# Altium schematic sheet 04.SchDoc
size 594 x 420 mm
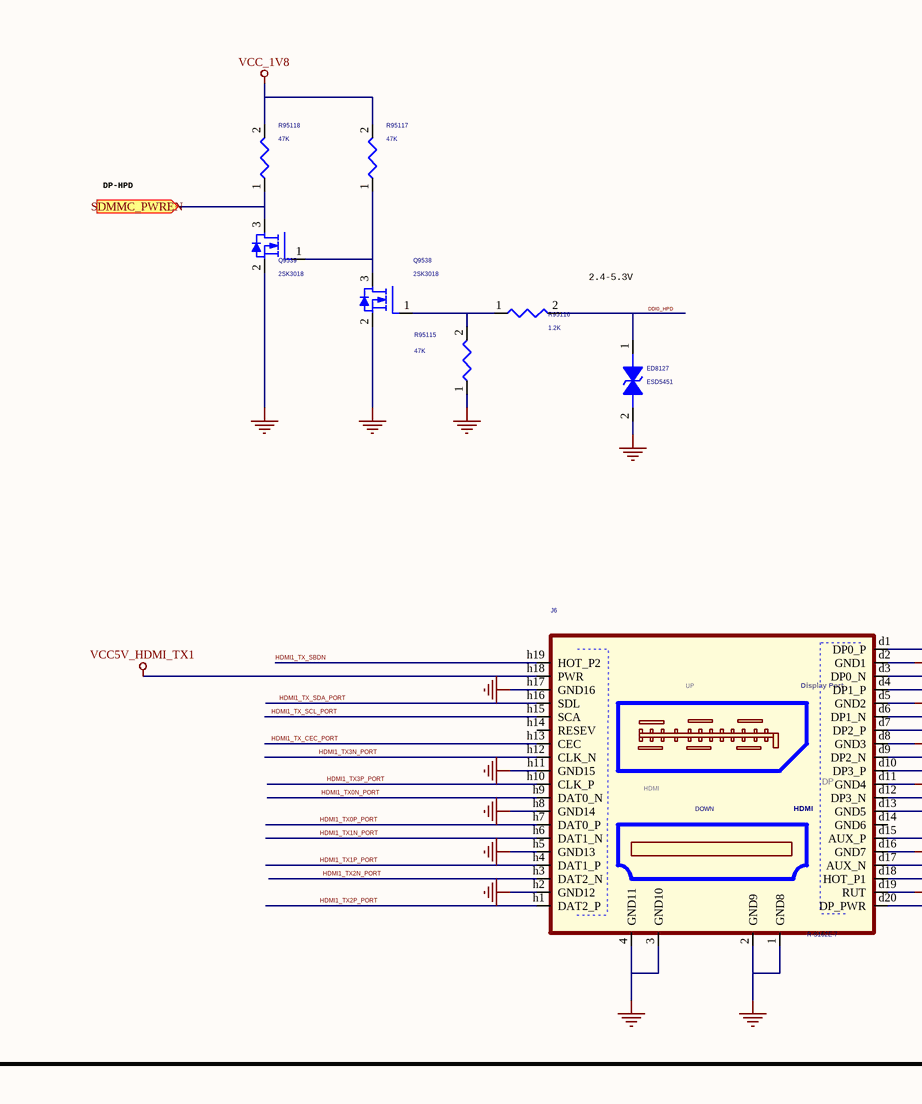
[diagram p0: 04.SchDoc, top left]
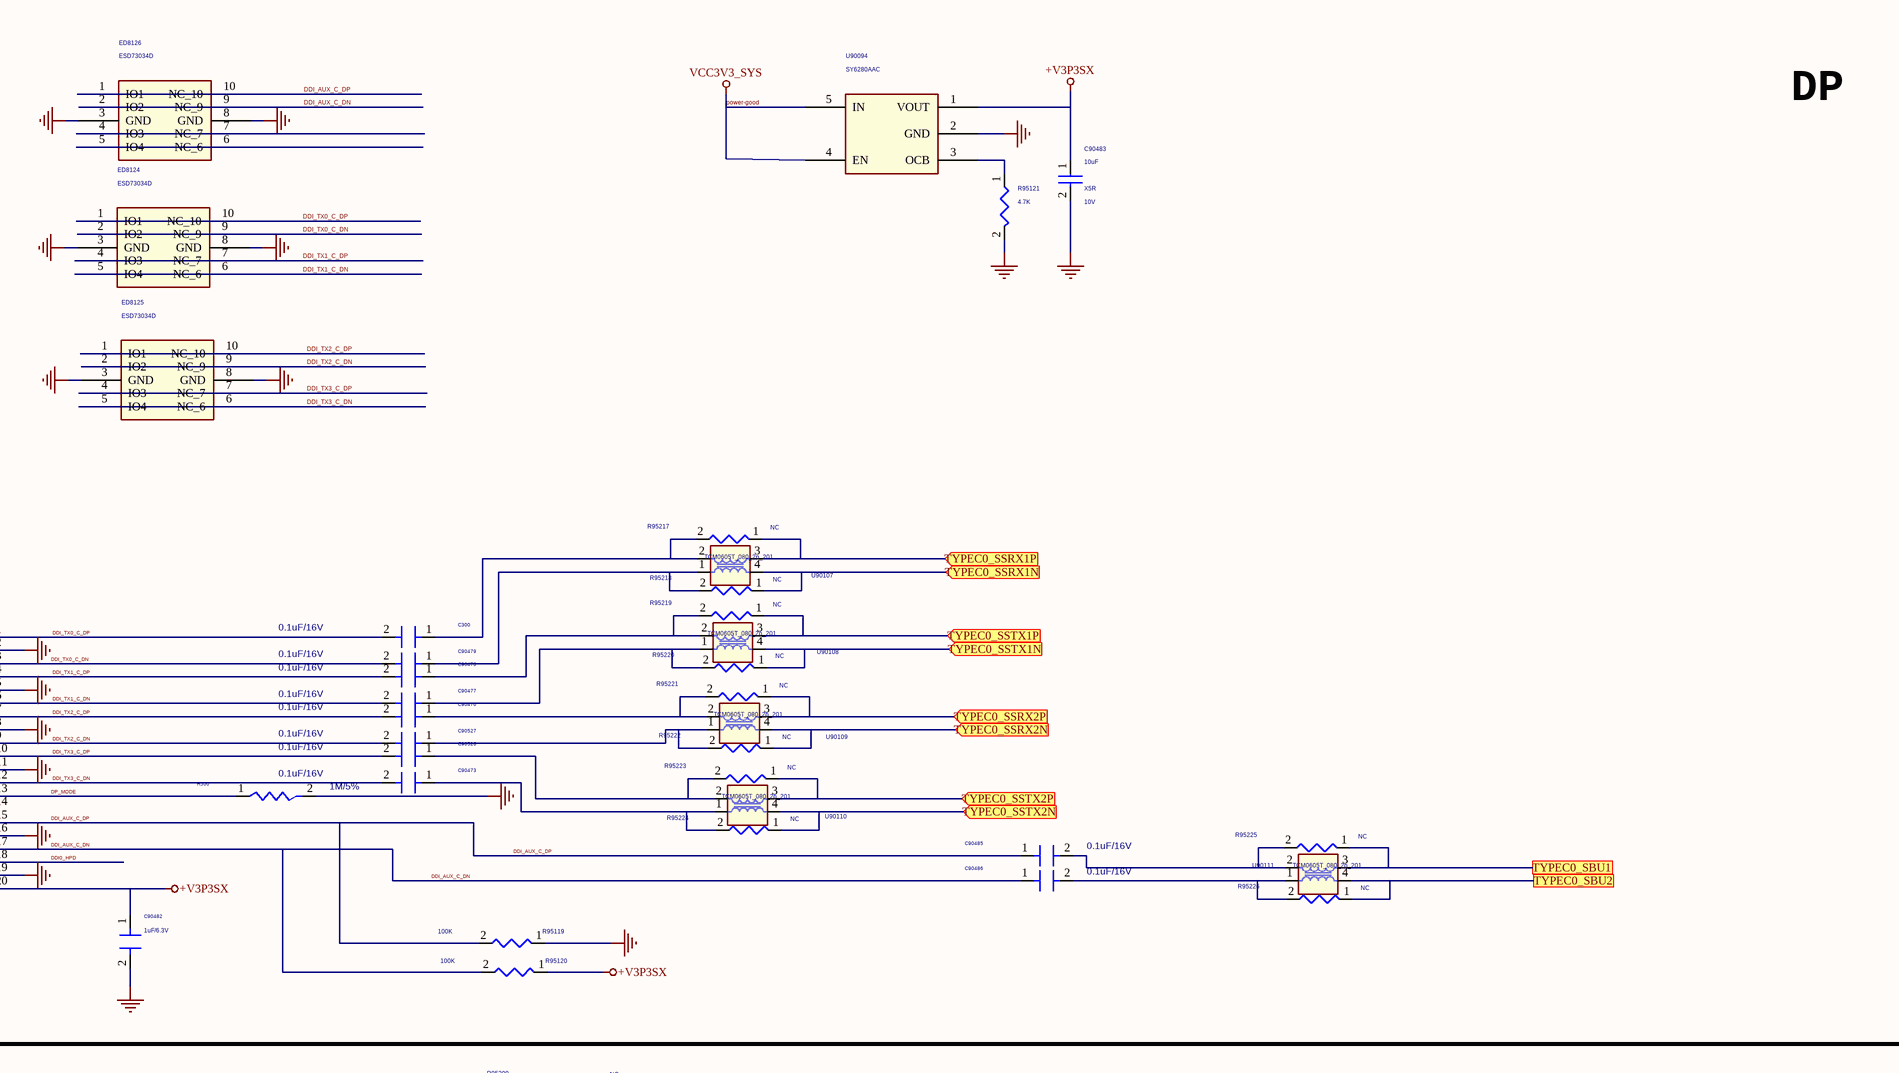
[diagram p1: 04.SchDoc, top right]
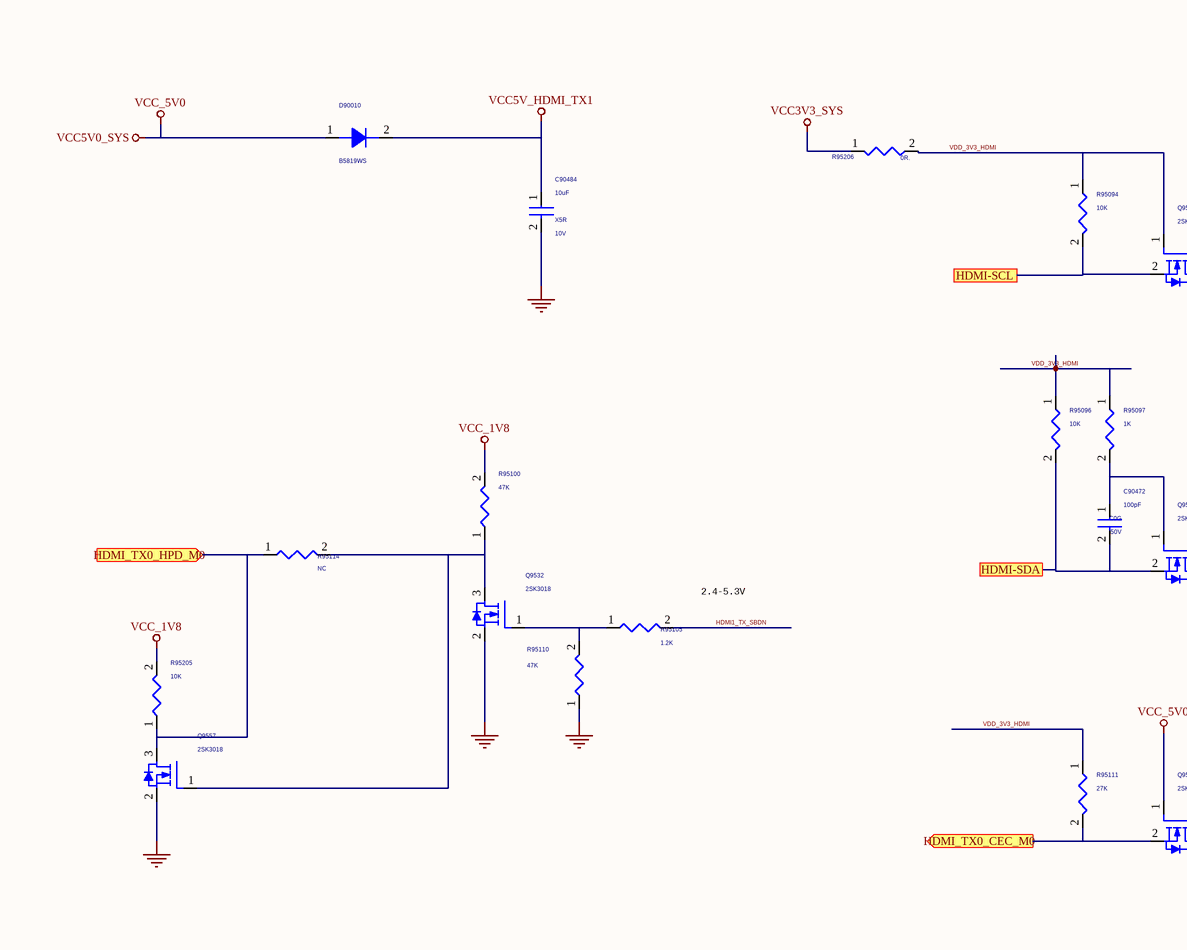
[diagram p2: 04.SchDoc, bottom left]
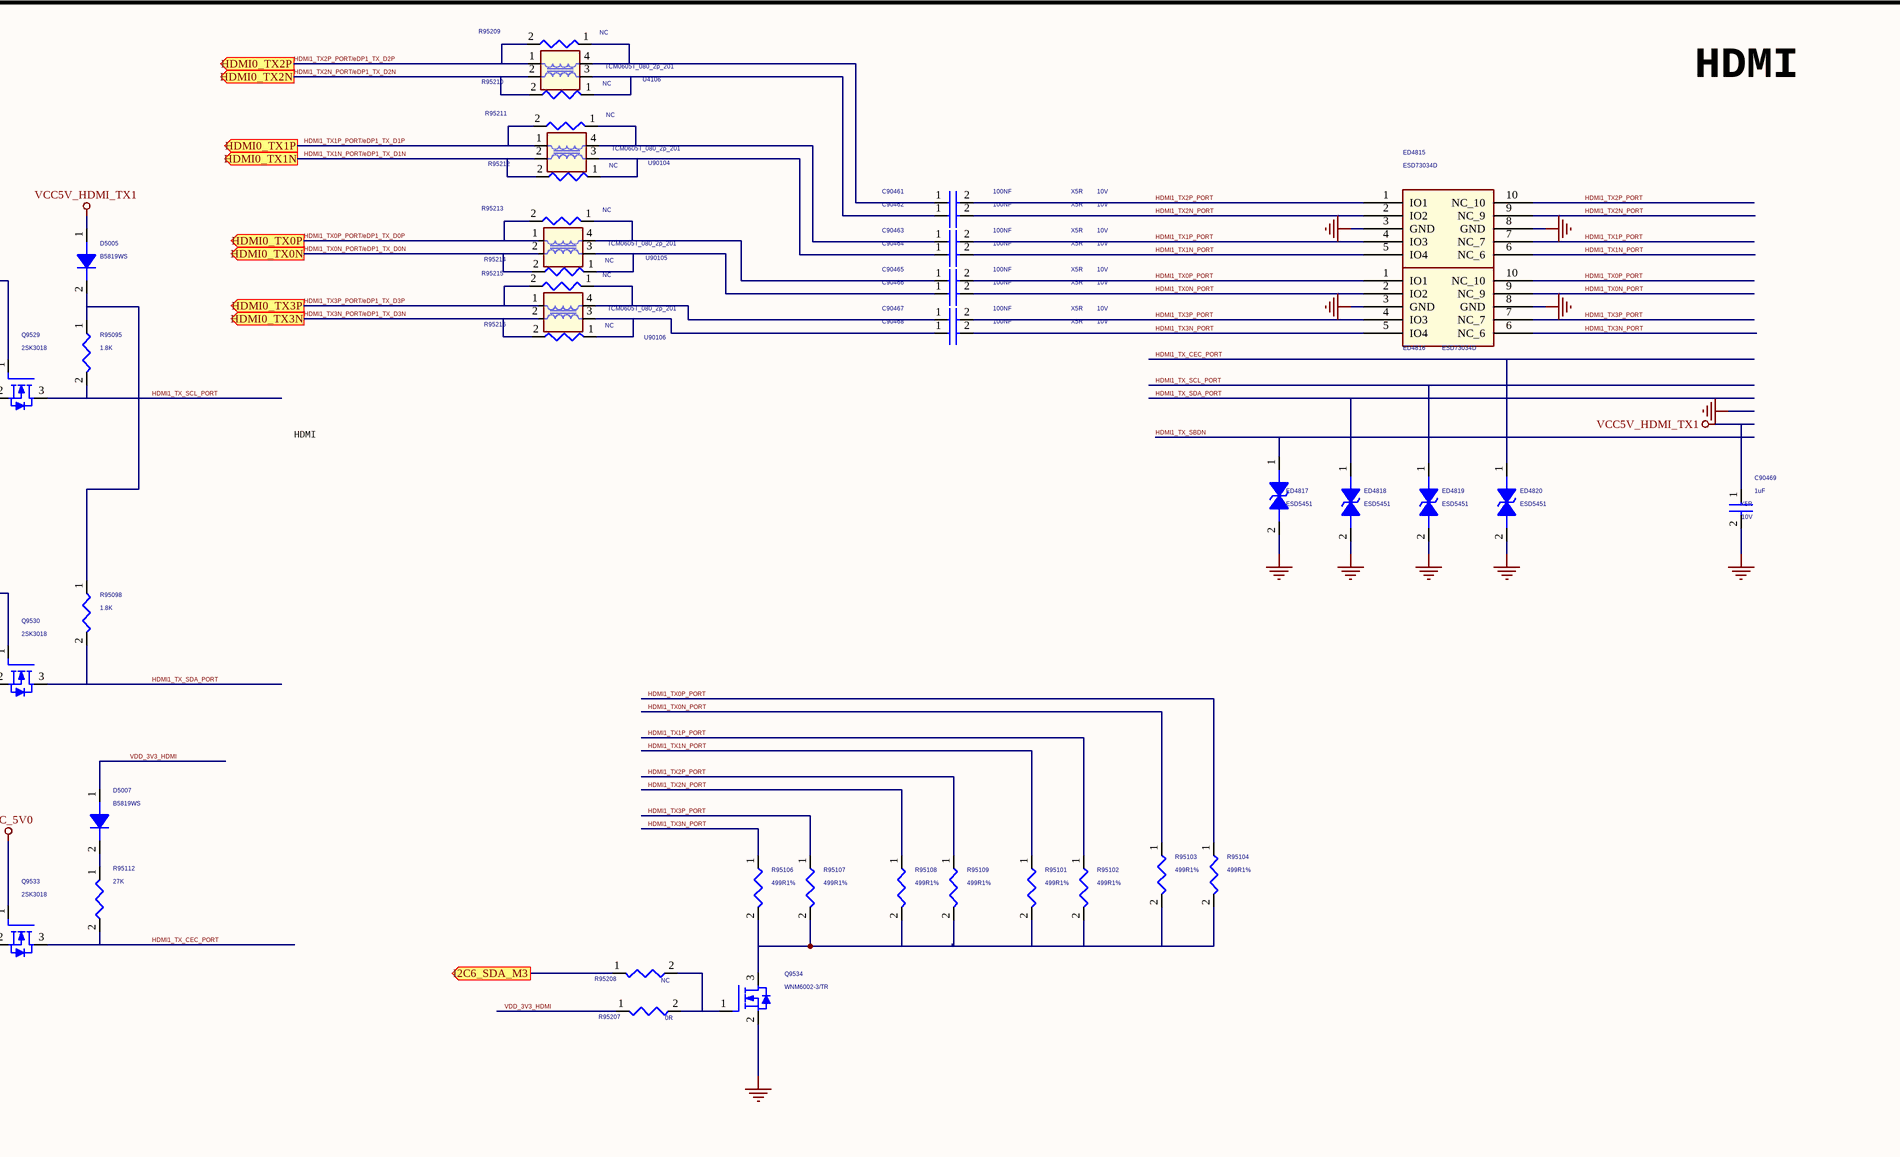
[diagram p3: 04.SchDoc, bottom right]

## Parts
C300  0.1uF/16V  [SMC0201]
C90461  100NF  Voltage: 10V  Dielectric: X5R  [C0201]
C90462  100NF  Voltage: 10V  Dielectric: X5R  [C0201]
C90463  100NF  Voltage: 10V  Dielectric: X5R  [C0201]
C90464  100NF  Voltage: 10V  Dielectric: X5R  [C0201]
C90465  100NF  Voltage: 10V  Dielectric: X5R  [C0201]
C90466  100NF  Voltage: 10V  Dielectric: X5R  [C0201]
C90467  100NF  Voltage: 10V  Dielectric: X5R  [C0201]
C90468  100NF  Voltage: 10V  Dielectric: X5R  [C0201]
C90469  1uF  Voltage: 10V  Dielectric: X5R  [C0402]
C90472  100pF  Voltage: 50V  Dielectric: C0G  [C0402]
C90473  0.1uF/16V  [SMC0201]
C90476  0.1uF/16V  [SMC0201]
C90477  0.1uF/16V  [SMC0201]
C90478  0.1uF/16V  [SMC0201]
C90479  0.1uF/16V  [SMC0201]
C90482  1uF/6.3V  [SMC0402]
C90483  10uF  Voltage: 10V  Dielectric: X5R  [C0603]
C90484  10uF  Voltage: 10V  Dielectric: X5R  [C0603]
C90485  0.1uF/16V  [SMC0201]
C90486  0.1uF/16V  [SMC0201]
C90526  0.1uF/16V  [SMC0201]
C90527  0.1uF/16V  [SMC0201]
D5005  B5819WS  [SOD_323]
D5007  B5819WS  [SOD_323]
D90010  B5819WS  [SOD_323]
ED4815  ESD73034D  [SON10_2R50X1R00X0R50]
ED4816  ESD73034D  [SON10_2R50X1R00X0R50]
ED4817  ESD5451  [ESD0402]
ED4818  ESD5451  [ESD0402]
ED4819  ESD5451  [ESD0402]
ED4820  ESD5451  [ESD0402]
ED8124  ESD73034D  [SON10_2R50X1R00X0R50]
ED8125  ESD73034D  [SON10_2R50X1R00X0R50]
ED8126  ESD73034D  [SON10_2R50X1R00X0R50]
ED8127  ESD5451  [ESD0402]
J6  R-S162E-7  [A]
Q9529  2SK3018  [SOT23]
Q9530  2SK3018  [SOT23]
Q9532  2SK3018  [SOT23]
Q9533  2SK3018  [SOT23]
Q9534  WNM6002-3/TR  [SOT23]
Q9538  2SK3018  [SOT23]
Q9539  2SK3018  [SOT23]
Q9557  2SK3018  [SOT23]
R500  1M/5%  [SMR0402]
R95094  10K  [R0402]
R95095  1.8K  [R0402]
R95096  10K  [R0402]
R95097  1K  [R0402]
R95098  1.8K  [R0402]
R95100  47K  [R0402]
R95101  499R1%  [R0402]
R95102  499R1%  [R0402]
R95103  499R1%  [R0402]
R95104  499R1%  [R0402]
R95105  1.2K  [R0402]
R95106  499R1%  [R0402]
R95107  499R1%  [R0402]
R95108  499R1%  [R0402]
R95109  499R1%  [R0402]
R95110  47K  [R0402]
R95111  27K  [R0402]
R95112  27K  [R0402]
R95114  NC  [R0402]
R95115  47K  [R0402]
R95116  1.2K  [R0402]
R95117  47K  [R0402]
R95118  47K  [R0402]
R95119  100K  [R0402]
R95120  100K  [R0402]
R95121  4.7K  [R0402]
R95205  10K  [R0402]
R95206  0R.  [R0402]
R95207  0R  [R0402]
R95208  NC  [R0402]
R95209  NC  [R0402]
R95210  NC  [R0402]
R95211  NC  [R0402]
R95212  NC  [R0402]
R95213  NC  [R0402]
R95214  NC  [R0402]
R95215  NC  [R0402]
R95216  NC  [R0402]
R95217  NC  [R0402]
R95218  NC  [R0402]
R95219  NC  [R0402]
R95220  NC  [R0402]
R95221  NC  [R0402]
R95222  NC  [R0402]
R95223  NC  [R0402]
R95224  NC  [R0402]
R95225  NC  [R0402]
R95226  NC  [R0402]
U4106  TCM0605T_080_2p_201  [QTCW2012]
U90094  SY6280AAC  [SOT_23_5]
U90104  TCM0605T_080_2p_201  [QTCW2012]
U90105  TCM0605T_080_2p_201  [QTCW2012]
U90106  TCM0605T_080_2p_201  [QTCW2012]
U90107  TCM0605T_080_2p_201  [QTCW2012]
U90108  TCM0605T_080_2p_201  [QTCW2012]
U90109  TCM0605T_080_2p_201  [QTCW2012]
U90110  TCM0605T_080_2p_201  [QTCW2012]
U90111  TCM0605T_080_2p_201  [QTCW2012]

## Ports
HDMI0_TX0N (out), HDMI0_TX0P (out), HDMI0_TX1N (out), HDMI0_TX1P (out), HDMI0_TX2N (out), HDMI0_TX2P (out), HDMI0_TX3N (out), HDMI0_TX3P (out), HDMI-SCL, HDMI-SDA, HDMI_TX0_CEC_M0 (out), HDMI_TX0_HPD_M0 (in), I2C6_SDA_M3 (out), SDMMC_PWREN (in), TYPEC0_SBU1, TYPEC0_SBU2, TYPEC0_SSRX1N (in), TYPEC0_SSRX1P (in), TYPEC0_SSRX2N (in), TYPEC0_SSRX2P (in), TYPEC0_SSTX1N (in), TYPEC0_SSTX1P (in), TYPEC0_SSTX2N (in), TYPEC0_SSTX2P (in)

## Nets
+V3P3SX: C90482.1(A[0]) C90483.1 J6.d20(DP_PWR) R95120.1 U90094.1(VOUT)
GND: C90469.2 C90482.2(B[0]) C90483.2 C90484.2 ED4815.3(GND) ED4815.8(GND) ED4816.3(GND) ED4816.8(GND) ED4817.2 ED4818.2 ED4819.2 ED4820.2 ED8124.3(GND) ED8124.8(GND) ED8125.3(GND) ED8125.8(GND) ED8126.3(GND) ED8126.8(GND) ED8127.2 J6.1(GND8) J6.2(GND9) J6.3(GND10) J6.4(GND11) J6.d2(GND1) J6.d5(GND2) J6.d8(GND3) J6.d11(GND4) J6.d16(GND7) J6.d19(RUT) J6.h2(GND12) J6.h5(GND13) J6.h8(GND14) J6.h11(GND15) J6.h17(GND16) Q9532.2(SOURCE) Q9534.2(SOURCE) Q9538.2(SOURCE) Q9539.2(SOURCE) Q9557.2(SOURCE) R500.2(B[0]) R95110.1 R95115.1 R95119.1 R95121.2 U90094.2(GND)
power-good: R95206.1 U90094.4(EN) U90094.5(IN)  [also labelled VCC3V3_SYS]
VCC5V0_SYS: D90010.1(A) Q9533.1(GATE)  [also labelled VCC_5V0]
VCC5V_HDMI_TX1: C90469.1 C90484.1 D5005.1(A) D90010.2(K) J6.h18(PWR)
VCC_1V8: R95100.2 R95117.2 R95118.2 R95205.2
DDI0_HPD: ED8127.1 J6.d18(HOT_P1) R95116.2
DDI_AUX_C_DN: C90486.1(A[0]) ED8126.2(IO2) ED8126.9(NC_9) J6.d17(AUX_N) R95120.2
DDI_AUX_C_DP: C90485.1(A[0]) ED8126.1(IO1) ED8126.10(NC_10) J6.d15(AUX_P) R95119.2
DDI_TX0_C_DN: C90479.2(B[0]) ED8124.2(IO2) ED8124.9(NC_9) J6.d3(DP0_N)
DDI_TX0_C_DP: C300.2(B[0]) ED8124.1(IO1) ED8124.10(NC_10) J6.d1(DP0_P)
DDI_TX1_C_DN: C90477.2(B[0]) ED8124.5(IO4) ED8124.6(NC_6) J6.d6(DP1_N)
DDI_TX1_C_DP: C90478.2(B[0]) ED8124.4(IO3) ED8124.7(NC_7) J6.d4(DP1_P)
DDI_TX2_C_DN: C90527.2(B[0]) ED8125.2(IO2) ED8125.9(NC_9) J6.d9(DP2_N)
DDI_TX2_C_DP: C90476.2(B[0]) ED8125.1(IO1) ED8125.10(NC_10) J6.d7(DP2_P)
DDI_TX3_C_DN: C90473.2(B[0]) ED8125.5(IO4) ED8125.6(NC_6) J6.d12(DP3_N)
DDI_TX3_C_DP: C90526.2(B[0]) ED8125.4(IO3) ED8125.7(NC_7) J6.d10(DP3_P)
DP_MODE: J6.d13(GND5) R500.1(A[0])
HDMI1_TX0N_PORT: C90466.2 ED4816.2(IO2) ED4816.9(NC_9) J6.h9(DAT0_N) R95103.1
HDMI1_TX0N_PORT/eDP1_TX_D0N: R95214.2 U90105.2 ; port HDMI0_TX0N
HDMI1_TX0P_PORT: C90465.2 ED4816.1(IO1) ED4816.10(NC_10) J6.h7(DAT0_P) R95104.1
HDMI1_TX0P_PORT/eDP1_TX_D0P: R95213.2 U90105.1 ; port HDMI0_TX0P
HDMI1_TX1N_PORT: C90464.2 ED4815.5(IO4) ED4815.6(NC_6) J6.h6(DAT1_N) R95101.1
HDMI1_TX1N_PORT/eDP1_TX_D1N: R95212.2 U90104.2 ; port HDMI0_TX1N
HDMI1_TX1P_PORT: C90463.2 ED4815.4(IO3) ED4815.7(NC_7) J6.h4(DAT1_P) R95102.1
HDMI1_TX1P_PORT/eDP1_TX_D1P: R95211.2 U90104.1 ; port HDMI0_TX1P
HDMI1_TX2N_PORT: C90462.2 ED4815.2(IO2) ED4815.9(NC_9) J6.h3(DAT2_N) R95108.1
HDMI1_TX2N_PORT/eDP1_TX_D2N: R95210.2 U4106.2 ; port HDMI0_TX2N
HDMI1_TX2P_PORT: C90461.2 ED4815.1(IO1) ED4815.10(NC_10) J6.h1(DAT2_P) R95109.1
HDMI1_TX2P_PORT/eDP1_TX_D2P: R95209.2 U4106.1 ; port HDMI0_TX2P
HDMI1_TX3N_PORT: C90468.2 ED4816.5(IO4) ED4816.6(NC_6) J6.h12(CLK_N) R95106.1
HDMI1_TX3N_PORT/eDP1_TX_D3N: R95216.2 U90106.2 ; port HDMI0_TX3N
HDMI1_TX3P_PORT: C90467.2 ED4816.4(IO3) ED4816.7(NC_7) J6.h10(CLK_P) R95107.1
HDMI1_TX3P_PORT/eDP1_TX_D3P: R95215.2 U90106.1 ; port HDMI0_TX3P
HDMI1_TX_CEC_PORT: ED4820.1 J6.h13(CEC) Q9533.3(DRAIN) R95112.2
HDMI1_TX_SBDN: ED4817.1 J6.h19(HOT_P2) R95105.2
HDMI1_TX_SCL_PORT: ED4819.1 J6.h15(SCA) Q9529.3(DRAIN) R95095.2
HDMI1_TX_SDA_PORT: ED4818.1 J6.h16(SDL) Q9530.3(DRAIN) R95098.2
HDMI-SCL: Q9529.2(SOURCE) R95094.2 ; port HDMI-SCL
HDMI-SDA: C90472.2 Q9530.2(SOURCE) R95096.2 ; port HDMI-SDA
HDMI_TX0_CEC_M0: Q9533.2(SOURCE) R95111.2 ; port HDMI_TX0_CEC_M0
HDMI_TX0_HPD_M0: Q9557.3(DRAIN) R95114.1 R95205.1 ; port HDMI_TX0_HPD_M0
I2C6_SDA_M3: R95208.1 ; port I2C6_SDA_M3
SDMMC_PWREN: Q9539.3(DRAIN) R95118.1 ; port SDMMC_PWREN
TYPEC0_SBU1: R95225.1 U90111.3 ; port TYPEC0_SBU1
TYPEC0_SBU2: R95226.1 U90111.4 ; port TYPEC0_SBU2
TYPEC0_SSRX1N: R95218.1 U90107.4 ; port TYPEC0_SSRX1N
TYPEC0_SSRX1P: R95217.1 U90107.3 ; port TYPEC0_SSRX1P
TYPEC0_SSRX2N: R95222.1 U90109.4 ; port TYPEC0_SSRX2N
TYPEC0_SSRX2P: R95221.1 U90109.3 ; port TYPEC0_SSRX2P
TYPEC0_SSTX1N: R95220.1 U90108.4 ; port TYPEC0_SSTX1N
TYPEC0_SSTX1P: R95219.1 U90108.3 ; port TYPEC0_SSTX1P
TYPEC0_SSTX2N: R95224.1 U90110.4 ; port TYPEC0_SSTX2N
TYPEC0_SSTX2P: R95223.1 U90110.3 ; port TYPEC0_SSTX2P
VDD_3V3_HDMI: D5007.1(A) Q9529.1(GATE) R95094.1 R95096.1 R95097.1 R95111.1 R95206.2 R95207.1
NetC300_1: C300.1(A[0]) R95217.2 U90107.2
NetC90461_1: C90461.1 R95209.1 U4106.4
NetC90462_1: C90462.1 R95210.1 U4106.3
NetC90463_1: C90463.1 R95211.1 U90104.4
NetC90464_1: C90464.1 R95212.1 U90104.3
NetC90465_1: C90465.1 R95213.1 U90105.4
NetC90466_1: C90466.1 R95214.1 U90105.3
NetC90467_1: C90467.1 R95215.1 U90106.4
NetC90468_1: C90468.1 R95216.1 U90106.3
NetC90472_1: C90472.1 Q9530.1(GATE) R95097.2
NetC90473_1: C90473.1(A[0]) R95224.2 U90110.1
NetC90476_1: C90476.1(A[0]) R95221.2 U90109.2
NetC90477_1: C90477.1(A[0]) R95220.2 U90108.1
NetC90478_1: C90478.1(A[0]) R95219.2 U90108.2
NetC90479_1: C90479.1(A[0]) R95218.2 U90107.1
NetC90485_2: C90485.2(B[0]) R95225.2 U90111.2
NetC90486_2: C90486.2(B[0]) R95226.2 U90111.1
NetC90526_1: C90526.1(A[0]) R95223.2 U90110.2
NetC90527_1: C90527.1(A[0]) R95222.2 U90109.1
NetD5005_2: D5005.2(K) R95095.1 R95098.1
NetD5007_2: D5007.2(K) R95112.1
NetED8126_4: ED8126.4(IO3) ED8126.7(NC_7)
NetED8126_5: ED8126.5(IO4) ED8126.6(NC_6)
NetQ9532_1: Q9532.1(GATE) R95105.1 R95110.2
NetQ9532_3: Q9532.3(DRAIN) Q9557.1(GATE) R95100.1 R95114.2
NetQ9534_1: Q9534.1(GATE) R95207.2 R95208.2
NetQ9534_3: Q9534.3(DRAIN) R95101.2 R95102.2 R95103.2 R95104.2 R95106.2 R95107.2 R95108.2 R95109.2
NetQ9538_1: Q9538.1(GATE) R95115.2 R95116.1
NetQ9538_3: Q9538.3(DRAIN) Q9539.1(GATE) R95117.1
NetR95121_1: R95121.1 U90094.3(OCB)

Not connected (* = marked no-connect by the designer): J6 d14(GND6) h14(RESEV)

## Notes on the sheet
- DP
- DP-HPD
- 2.4-5.3V
- HDMI
- (near R95105) 2.4-5.3V
- (in symbol DP+HDMI_1) UP; Display Port; DP; HDMI; DOWN

## Library data of the parts
C300 C90473 C90476 C90486 C90526 = CAP_ALTSIZE: PART_NUMBER: J30788-001; CDS_PART_NAME: CAP_ALTSIZE_0402-0.22UF,10%,16A; MATERIAL: X5R; PACK_TYPE: 0402; ROOM: USB_TYPE_C; TOLERANCE: 10%; VOLTAGE: 16V; OriginalSymbolOrigin: (-50,50); POP2: TYPEC_DP_USB; POP: BASE; CDS_LIB: capacitor; CDS_LOCATION: C4532; DRAWING: @APL_FF_LIN.APL_FF(SCH_1):PAGE72; PHYS_PAGE: 43; ROT: 0; SUB_ROOM: AC_CAP; VER: 2; XY: (-1275,4600); SIZE: 1B; VARIANT: ?; STUFF: STUFF; CDS_PHYS_PART_NAME: CAP_ALTSIZE_0402-0.22UF,10%,16A; CHIPS_PART_NAME: CAP_ALTSIZE; LOCATION: C4532
C90461 C90463 C90465 C90467 C90468 = CAP NP: cap,220.00nF,+/-10%,10V,X5R,C0201; Manufacturer PN: C0603X5R1A224K030BB; Manufacturer: TDK; Tolerance: 10%; Priority: A; Created by: JJJ; Part Type: C0201; RK PN: C0603X5R1A224K030BB
C90462 C90464 C90466 = CAP NP: cap,220.00nF,+/-10%,10V,X5R,C0201; Manufacturer: TDK; RK PN: C0603X5R1A224K030BB; Priority: A; Tolerance: 10%; Part Type: C0201; Manufacturer PN: C0603X5R1A224K030BB; Created by: JJJ
C90469 = CAP NP: cap,1.00uF,+/-10%,10V,X5R,C0402; Manufacturer PN: C1005X5R1A105K050BB; Manufacturer: TDK; Tolerance: 10%; Priority: A; Number: 37; Created by: JJJ; C_Voltage: 10V; Part Type: C0402; RK PN: C1005X5R1A105K050BB
C90472 = CAP NP: cap,100.00pF,+/-10%,50V,C0G,C0402; Manufacturer: TDK; Number: 37; RK PN: C1005C0G1H101K050BA; Priority: A; Tolerance: 10%; C_Voltage: 10V; Part Type: C0402; Manufacturer PN: C1005C0G1H101K050BA; Created by: JJJ
C90477 C90479 C90485 C90527 = CAP_ALTSIZE: PART_NUMBER: J30788-001; CDS_PHYS_PART_NAME: CAP_ALTSIZE_0402-0.22UF,10%,16A; MATERIAL: X5R; PACK_TYPE: 0402; ROOM: USB_TYPE_C; TOLERANCE: 10%; VOLTAGE: 16V; OriginalSymbolOrigin: (-50,50); POP2: TYPEC_DP_USB; XY: (-1275,4600); VER: 2; SUB_ROOM: AC_CAP; ROT: 0; PHYS_PAGE: 43; LOCATION: C4532; DRAWING: @APL_FF_LIN.APL_FF(SCH_1):PAGE72; CDS_LIB: capacitor; POP: BASE; SIZE: 1B; VARIANT: ?; CHIPS_PART_NAME: CAP_ALTSIZE; CDS_PART_NAME: CAP_ALTSIZE_0402-0.22UF,10%,16A; CDS_LOCATION: C4532; STUFF: STUFF
C90478 = CAP_ALTSIZE: PART_NUMBER: J30788-001; CDS_PHYS_PART_NAME: CAP_ALTSIZE_0402-0.22UF,10%,16A; MATERIAL: X5R; PACK_TYPE: 0402; ROOM: USB_TYPE_C; TOLERANCE: 10%; VOLTAGE: 16V; OriginalSymbolOrigin: (-50,50); XY: (-1275,4600); VER: 2; SUB_ROOM: AC_CAP; ROT: 0; PHYS_PAGE: 43; LOCATION: C4532; DRAWING: @APL_FF_LIN.APL_FF(SCH_1):PAGE72; CDS_LIB: capacitor; POP: BASE; POP2: TYPEC_DP_USB; SIZE: 1B; VARIANT: ?; CHIPS_PART_NAME: CAP_ALTSIZE; CDS_PART_NAME: CAP_ALTSIZE_0402-0.22UF,10%,16A; CDS_LOCATION: C4532; STUFF: STUFF
C90482 = CAP_2: PART_NUMBER: H35094-001; CDS_PART_NAME: CAP_0402-2.2UF,20%,10V,X5R,H35A; CHIPS_PART_NAME: CAP; OriginalSymbolOrigin: (-50,50); VOLTAGE: 10V; TOLERANCE: 20%; ROOM: DISPLAY_HDMI; PACK_TYPE: 0402; MATERIAL: X5R; POP: BASE; CDS_LIB: capacitor; CDS_LOCATION: C9589; DRAWING: @APL_FF_LIN.APL_FF(SCH_1):PAGE35; PHYS_PAGE: 35; ROT: 0; SUB_ROOM: DECOUPLING; VER: 1; XY: (-3350,2800); POP2: _; VARIANT: ?; SIZE: 1B; REV: V2.0; LOCATION: C9589; SEC_TYPE: 0402; CDS_PHYS_PART_NAME: CAP_0402-2.2UF,20%,10V,X5R,H35A; STUFF: STUFF
C90483 C90484 = CAP NP: cap,10.00uF,+/-10%,10V,X5R,C0805; Manufacturer PN: C2012X5R1A106K125AB; Manufacturer: TDK; Tolerance: 10%; Priority: A; Created by: JJJ; Part Type: C0805; RK PN: C2012X5R1A106K125AB
D5005 = DIODE_Dup2: Schottky Barrier，B5819WS SOD-323; Manufacturer: 长电; Priority: A; RK PN: B5819WS; Part Type: Schottky rectifier; Manufacturer PN: B5819WS; Created by: JJJ
D5007 = DIODE_Dup2: Schottky Barrier，B5819WS SOD-323; Manufacturer: 长电; option: DNP; Priority: A; RK PN: B5819WS; Part Type: Schottky rectifier; Manufacturer PN: B5819WS; Created by: JJJ
D90010 = DIODE_Dup2: Schottky Barrier，B5819WS SOD-323; Manufacturer: 长电; Priority: A; option: DNP; Created by: JJJ; Manufacturer PN: B5819WS; Part Type: Schottky rectifier; RK PN: B5819WS
ED4815 ED4816 ED8124-ED8126 = ESD_ESD5304D: 4-Lines, Uni-directional, Ultra-low Capacitance Transient Voltage Suppressors; Manufacturer: WillSemi(韦尔半导体); Priority: A; RK PN: ESD5304D; Part Type: ESD_TVS; Manufacturer PN: ESD5304D; Created by: JJJ
ED4817-ED4820 = DIODE BI_DIR TRIG: 1-Line, Bi-directional, Transient Voltage Suppressors.1pF.; Manufacturer PN: ESD5341N; Manufacturer: WillSemi(韦尔半导体); Priority: A; Created by: JJJ; Part Type: ESD_TVS; RK PN: ESD5341N
ED8127 = DIODE BI_DIR TRIG: 1-Line, Bi-directional, Transient Voltage Suppressors.1pF.; Manufacturer: WillSemi(韦尔半导体); RK PN: ESD5341N; Priority: A; Part Type: ESD_TVS; Manufacturer PN: ESD5341N; Created by: JJJ
J6 = DP+HDMI_1: CONN DP+HDMI 62EHDS3 39P+4J+2定位柱 卧式 DIP-45 NPB; COMPSIDE: S_BOT; POP: BASE; Remark: Reserved; STUFF: STUFF
Q9529 Q9530 Q9532 Q9533 Q9557 = MOSFET N_0: NMOS,2SK3018,SOT_323,Id=0.1A,Vds=30V; Manufacturer: ROHM; Pd: 0.2W; Vgsth: 1.5V; VDS: 30V; Vgs: 20V; Id_max: 0.1A; Priority: A; Rds: 5ohm; Created by: JJJ; Manufacturer PN: 2SK3018; Part Type: NMOS; RK PN: 2SK3018
Q9534 = MOSFET N_0: NMOS,WNM6002-3/TR,SOT_323,Id=0.3A,Vds=60V; Manufacturer: WillSemi(韦尔半导体); Pd: 0.23W; Vgsth: 1.3V; VDS: 60V; Vgs: ±20V; Id_max: 0.3A; Priority: A; Created by: JJJ; Manufacturer PN: WNM6002-3/TR; Part Type: NMOS; RK PN: WNM6002-3/TR
Q9538 Q9539 = MOSFET N_0: NMOS,2SK3018,SOT_323,Id=0.1A,Vds=30V; Manufacturer: ROHM; Rds: 5ohm; Priority: A; Id_max: 0.1A; Vgs: 20V; VDS: 30V; Vgsth: 1.5V; Pd: 0.2W; RK PN: 2SK3018; Part Type: NMOS; Manufacturer PN: 2SK3018; Created by: JJJ
R500 = RES#2: PART_NUMBER: A93549-023; CHIPS_PART_NAME: RES; CDS_PHYS_PART_NAME: RES_0402-10K,5%,1/16W,CH,A9354A; PACK_TYPE: 0402; ROOM: USB_TYPE_C; TOLERANCE: 5%; WATTAGE: 1/16W; OriginalSymbolOrigin: (-50,100); POP: BASE; XY: (-2550,2250); VER: 2; SUB_ROOM: MISC; ROT: 0; PHYS_PAGE: 43; LOCATION: R4590; DRAWING: @APL_FF_LIN.APL_FF(SCH_1):PAGE72; CDS_LIB: resistor; POP2: TYPEC_DP_USB; MATERIAL: CH; SIZE: 1B; STUFF: STUFF; CDS_PART_NAME: RES_0402-10K,5%,1/16W,CH,A9354A; CDS_LOCATION: R4590
R95094 R95208-R95224 = RESISTOR: 通用厚膜电阻,10K,+/-5%,R0402,1/16W.; Manufacturer PN: RC0402JR-0710KL; Manufacturer: YAGEO; Tolerance: 5%; Wattage: 1/16W; Priority: A; Created by: YTL; Part Type: 通用厚膜电阻; RK PN: RC0402JR-0710KL
R95095 = RESISTOR: 通用厚膜电阻,1K8,+/-5%,R0402,1/16W.; Manufacturer: YAGEO; Tolerance: 5%; RK PN: RC0402JR-071K8L; Priority: A; Wattage: 1/16W; Part Type: 通用厚膜电阻; Manufacturer PN: RC0402JR-071K8L; Created by: YTL
R95096 R95206 R95207 R95225 R95226 = RESISTOR: 通用厚膜电阻,10K,+/-5%,R0402,1/16W.; Manufacturer: YAGEO; Tolerance: 5%; RK PN: RC0402JR-0710KL; Priority: A; Wattage: 1/16W; Part Type: 通用厚膜电阻; Manufacturer PN: RC0402JR-0710KL; Created by: YTL
R95097 = RESISTOR: 通用厚膜电阻,1K,+/-5%,R0402,1/16W.; Manufacturer PN: RC0402JR-071KL; Manufacturer: YAGEO; Tolerance: 5%; Wattage: 1/16W; Priority: A; Created by: YTL; Part Type: 通用厚膜电阻; RK PN: RC0402JR-071KL
R95098 = RESISTOR: 通用厚膜电阻,1K8,+/-5%,R0402,1/16W.; Manufacturer PN: RC0402JR-071K8L; Manufacturer: YAGEO; Tolerance: 5%; Wattage: 1/16W; Priority: A; Created by: YTL; Part Type: 通用厚膜电阻; RK PN: RC0402JR-071K8L
R95100 R95115 R95117 = RESISTOR: 通用厚膜电阻,47K,+/-5%,R0402,1/16W.; Manufacturer: YAGEO; Tolerance: 5%; RK PN: RC0402JR-0747KL; Priority: A; Wattage: 1/16W; Part Type: 通用厚膜电阻; Manufacturer PN: RC0402JR-0747KL; Created by: YTL
R95101 R95103 R95107-R95109 = RESISTOR: 通用厚膜电阻,499R,+/-1%,R0201,1/20W.; Manufacturer PN: RC0201FR-07499RL; Manufacturer: YAGEO; Tolerance: 1%; Wattage: 1/20W; Priority: A; Created by: YTL; Part Type: 通用厚膜电阻; RK PN: RC0201FR-07499RL
R95102 R95104 R95106 = RESISTOR: 通用厚膜电阻,499R,+/-1%,R0201,1/20W.; Manufacturer: YAGEO; Tolerance: 1%; RK PN: RC0201FR-07499RL; Priority: A; Wattage: 1/20W; Part Type: 通用厚膜电阻; Manufacturer PN: RC0201FR-07499RL; Created by: YTL
R95105 R95114 = RESISTOR: 通用厚膜电阻,1K2,+/-5%,R0402,1/16W.; Manufacturer PN: RC0402JR-071K2L; Manufacturer: YAGEO; Tolerance: 5%; Wattage: 1/16W; Priority: A; Created by: YTL; Part Type: 通用厚膜电阻; RK PN: RC0402JR-071K2L
R95110 R95118 R95205 = RESISTOR: 通用厚膜电阻,47K,+/-5%,R0402,1/16W.; Manufacturer PN: RC0402JR-0747KL; Manufacturer: YAGEO; Tolerance: 5%; Wattage: 1/16W; Priority: A; Created by: YTL; Part Type: 通用厚膜电阻; RK PN: RC0402JR-0747KL
R95111 = RESISTOR: 通用厚膜电阻,27K,+/-5%,R0402,1/16W.; Manufacturer PN: RC0402JR-0727KL; Manufacturer: YAGEO; Tolerance: 5%; Wattage: 1/16W; Priority: A; Created by: YTL; Part Type: 通用厚膜电阻; RK PN: RC0402JR-0727KL
R95112 = RESISTOR: 通用厚膜电阻,27K,+/-5%,R0402,1/16W.; Manufacturer PN: RC0402JR-0727KL; Manufacturer: YAGEO; Tolerance: 5%; OPTION: DNP; Wattage: 1/16W; Priority: A; Created by: YTL; Part Type: 通用厚膜电阻; RK PN: RC0402JR-0727KL
R95116 = RESISTOR: 通用厚膜电阻,1K2,+/-5%,R0402,1/16W.; Manufacturer: YAGEO; Tolerance: 5%; RK PN: RC0402JR-071K2L; Priority: A; Wattage: 1/16W; Part Type: 通用厚膜电阻; Manufacturer PN: RC0402JR-071K2L; Created by: YTL
R95119 = RESISTOR: 通用厚膜电阻,100K,+/-5%,R0402,1/16W.; Manufacturer PN: RC0402JR-07100KL; Manufacturer: YAGEO; Tolerance: 5%; Wattage: 1/16W; Priority: A; Created by: YTL; Part Type: 通用厚膜电阻; RK PN: RC0402JR-07100KL
R95120 = RESISTOR: 通用厚膜电阻,100K,+/-5%,R0402,1/16W.; Manufacturer: YAGEO; Tolerance: 5%; RK PN: RC0402JR-07100KL; Priority: A; Wattage: 1/16W; Part Type: 通用厚膜电阻; Manufacturer PN: RC0402JR-07100KL; Created by: YTL
R95121 = RESISTOR: 通用厚膜电阻,9K1,+/-1%,R0402,1/16W.; Manufacturer: YAGEO; Tolerance: 1%; RK PN: RC0402FR-079K1L; Priority: A; Wattage: 1/16W; Part Type: 通用厚膜电阻; Manufacturer PN: RC0402FR-079K1L; Created by: YTL
U4106 U90104-U90111 = QTCW2012-090-LF_0: Part-V: NC-E2012-090-F
U90094 = SWITCH_SY6280: Low Loss Power Distribution Switch; Manufacturer: Silergy（矽力杰）; Priority: A; RK PN: SY6280AAC; Part Type: Switch; Manufacturer PN: SY6280AAC; Created by: JJJ